# EAGLE schematic 4ButtonSwitch.Rev3.0 (EAGLE 8.6.0)
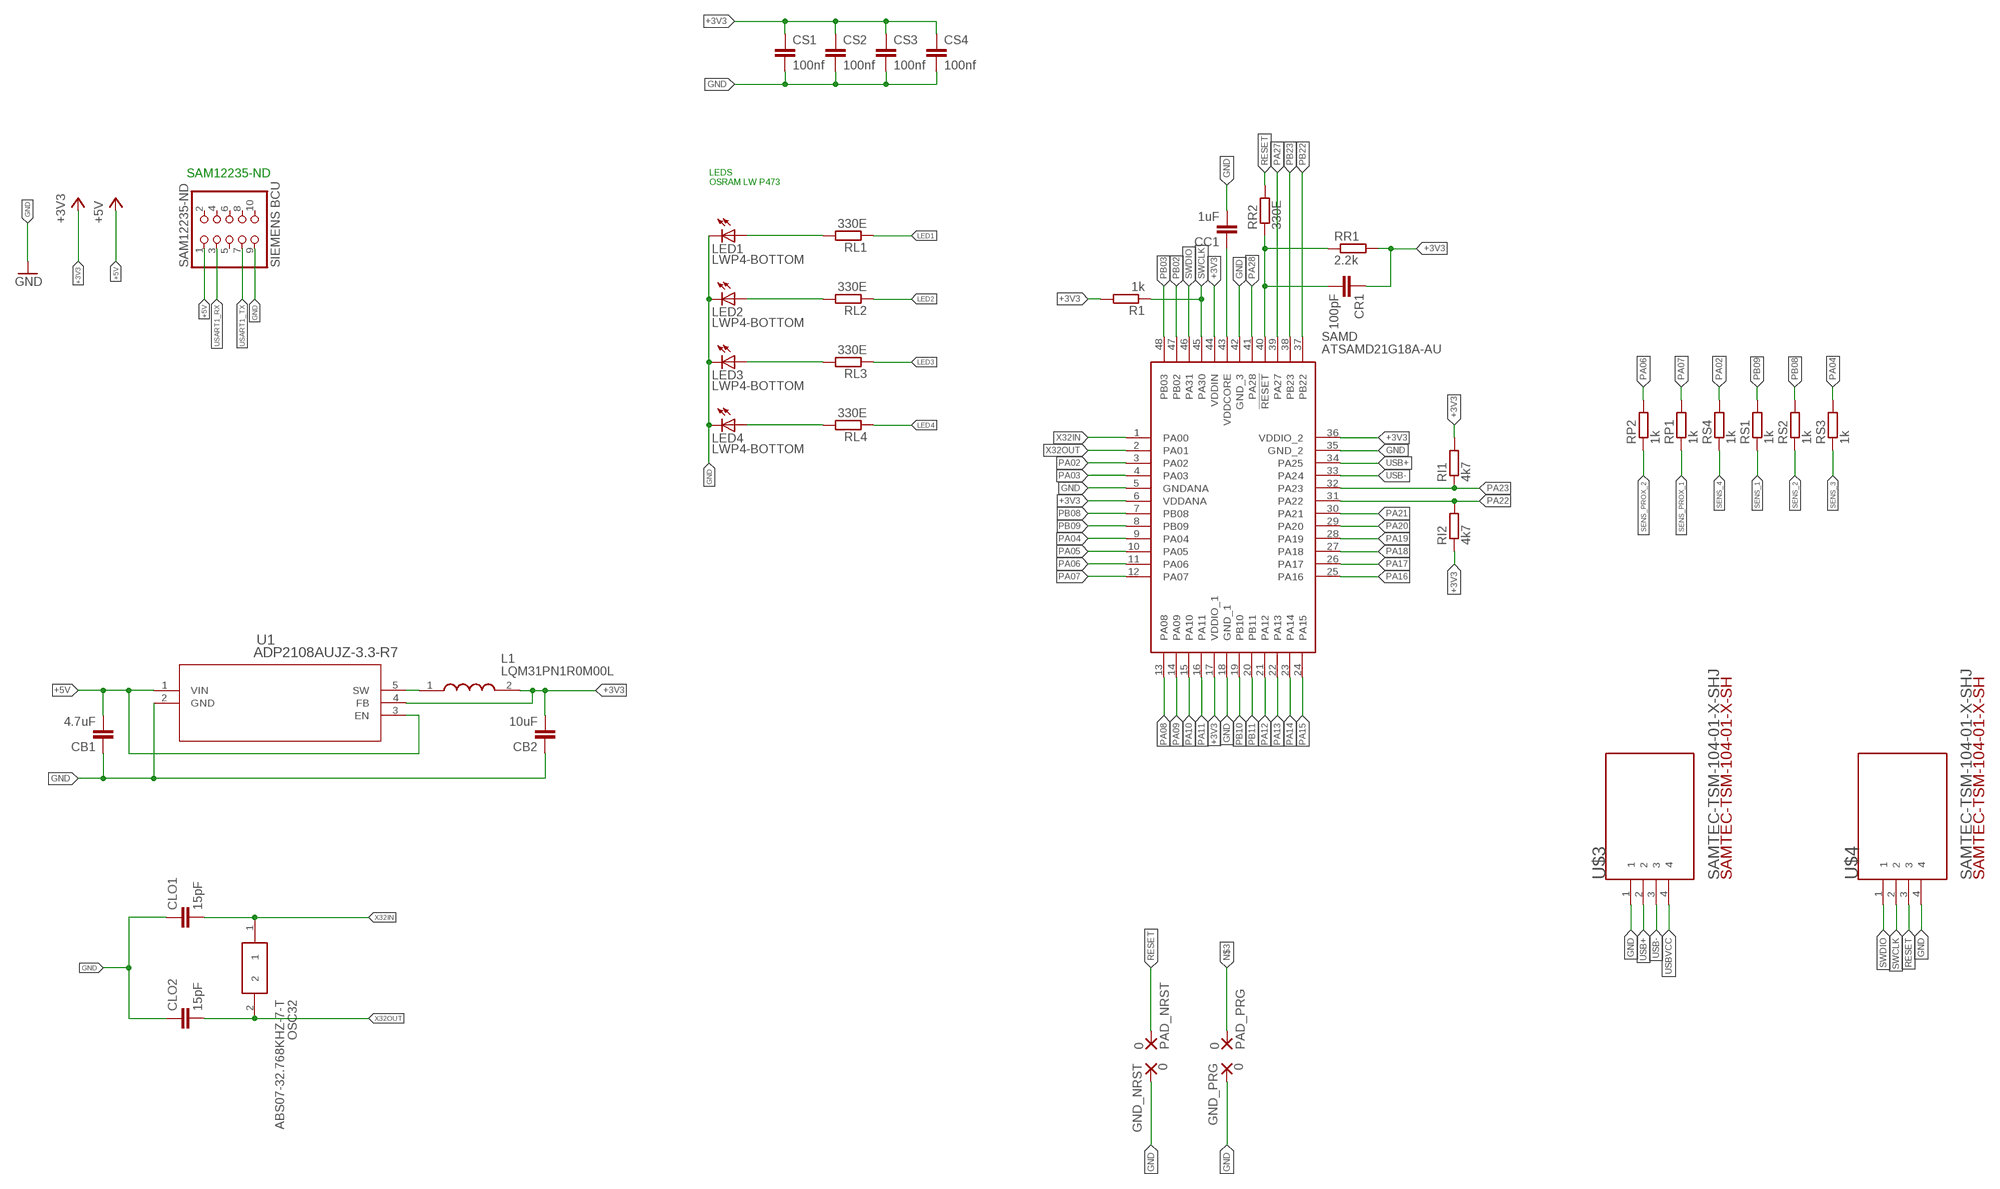
[diagram p0: schematic, sheet 1]

## Parts
CB1  4.7uF  C-EUC1206  [C1206]
CB2  10uF  C-EUC1206  [C1206]
CC1  1uF  C-EUC1206  [C1206]
CLO1  15pF  C-EUC1206  [C1206]
CLO2  15pF  C-EUC1206  [C1206]
CR1  100pF  C-EUC1206  [C1206]
CS1  100nf  C-EUC1206  [C1206]
CS2  100nf  C-EUC1206  [C1206]
CS3  100nf  C-EUC1206  [C1206]
CS4  100nf  C-EUC1206  [C1206]
GND_NRST  0  SMD5  [SMD2,54-5,08]
GND_PRG  0  SMD5  [SMD2,54-5,08]
L1  LQM31PN1R0M00L  [INDC3216X95N]
LED1  LWP4-BOTTOM  [P47F-BOTTOM]
LED2  LWP4-BOTTOM  [P47F-BOTTOM]
LED3  LWP4-BOTTOM  [P47F-BOTTOM]
LED4  LWP4-BOTTOM  [P47F-BOTTOM]
OSC32  ABS07-32.768KHZ-7-T  [ABS-07]
PAD_NRST  0  SMD5  [SMD2,54-5,08]
PAD_PRG  0  SMD5  [SMD2,54-5,08]
R1  1k  R-EU_R1206  [R1206]
RI1  4k7  R-EU_R1206  [R1206]
RI2  4k7  R-EU_R1206  [R1206]
RL1  330E  R-EU_R1206  [R1206]
RL2  330E  R-EU_R1206  [R1206]
RL3  330E  R-EU_R1206  [R1206]
RL4  330E  R-EU_R1206  [R1206]
RP1  1k  R-EU_R1206  [R1206]
RP2  1k  R-EU_R1206  [R1206]
RR1  2.2k  R-EU_R1206  [R1206]
RR2  330E  R-EU_R1206  [R1206]
RS1  1k  R-EU_R1206  [R1206]
RS2  1k  R-EU_R1206  [R1206]
RS3  1k  R-EU_R1206  [R1206]
RS4  1k  R-EU_R1206  [R1206]
SAM12235-ND  SIEMENS BCU  PINHD-2X5_2.54-SMD  [2X05SMD]
SAMD  ATSAMD21G18A-AU  [QFP50P900X900X120-48N]
U1  ADP2108AUJZ-3.3-R7  [UJ_5]
U$3  SAMTEC-TSM-104-01-X-SHJ  [SAMTEC-TSM-104-01-X-SH]
U$4  SAMTEC-TSM-104-01-X-SHJ  [SAMTEC-TSM-104-01-X-SH]

## Nets
+3V3: CB2.2 CR1.1 CS1.1 CS2.1 CS3.1 CS4.1 L1.2 R1.2 RI1.2 RI2.1 RR1.2 SAMD.6(VDDANA) SAMD.17(VDDIO_1) SAMD.36(VDDIO_2) SAMD.44(VDDIN) U1.4(FB)
+5V: CB1.2 SAM12235-ND.1 U1.1(VIN) U1.3(EN)
GND: CB1.1 CB2.1 CC1.2 CLO1.1 CLO2.1 CS1.2 CS2.2 CS3.2 CS4.2 GND_NRST.1(P) GND_PRG.1(P) LED1.C LED2.C LED3.C LED4.C SAM12235-ND.9 SAMD.5(GNDANA) SAMD.18(GND_1) SAMD.35(GND_2) SAMD.42(GND_3) U1.2(GND) U$3.1 U$4.4
LED1: RL1.1
LED2: RL2.1
LED3: RL3.1
LED4: RL4.1
N$2: L1.1 U1.5(SW)
N$3: PAD_PRG.1(P)
N$19: LED1.A RL1.2
N$20: LED2.A RL2.2
N$21: LED3.A RL3.2
N$22: LED4.A RL4.2
NRST: CR1.2 RR1.1 RR2.1 SAMD.40(!RESET)
PA02: RS4.2 SAMD.3(PA02)
PA03: SAMD.4(PA03)
PA04: RS3.2 SAMD.9(PA04)
PA05: SAMD.10(PA05)
PA06: RP2.2 SAMD.11(PA06)
PA07: RP1.2 SAMD.12(PA07)
PA08: SAMD.13(PA08)
PA09: SAMD.14(PA09)
PA10: SAMD.15(PA10)
PA11: SAMD.16(PA11)
PA12: SAMD.21(PA12)
PA13: SAMD.22(PA13)
PA14: SAMD.23(PA14)
PA15: SAMD.24(PA15)
PA16: SAMD.25(PA16)
PA17: SAMD.26(PA17)
PA18: SAMD.27(PA18)
PA19: SAMD.28(PA19)
PA20: SAMD.29(PA20)
PA21: SAMD.30(PA21)
PA22: RI2.2 SAMD.31(PA22)
PA23: RI1.1 SAMD.32(PA23)
PA27: SAMD.39(PA27)
PA28: SAMD.41(PA28)
PB02: SAMD.47(PB02)
PB03: SAMD.48(PB03)
PB08: RS2.2 SAMD.7(PB08)
PB09: RS1.2 SAMD.8(PB09)
PB10: SAMD.19(PB10)
PB11: SAMD.20(PB11)
PB22: SAMD.37(PB22)
PB23: SAMD.38(PB23)
RESET: PAD_NRST.1(P) RR2.2 U$4.3
SENS_1: RS1.1
SENS_2: RS2.1
SENS_3: RS3.1
SENS_4: RS4.1
SENS_PROX_1: RP1.1
SENS_PROX_2: RP2.1
SWCLK: R1.1 SAMD.45(PA30) U$4.2
SWDIO: SAMD.46(PA31) U$4.1
USART1_RX: SAM12235-ND.3
USART1_TX: SAM12235-ND.7
USB+: SAMD.34(PA25) U$3.2
USB-: SAMD.33(PA24) U$3.3
USBVCC: U$3.4
VDDCORE: CC1.1 SAMD.43(VDDCORE)
X32IN: CLO1.2 OSC32.1 SAMD.1(PA00)
X32OUT: CLO2.2 OSC32.2 SAMD.2(PA01)
Unconnected: SAM12235-ND.2 SAM12235-ND.4 SAM12235-ND.5 SAM12235-ND.6 SAM12235-ND.8 SAM12235-ND.10

## Notes on the sheet
- SAM12235-ND
- LEDS
  OSRAM LW P473

## Library data of the parts
CB1 CB2 CC1 CLO1 CLO2 CR1 CS1-CS4 = rcl:C-EU: CAPACITOR, European symbol; SPICEPREFIX: C
GND_NRST GND_PRG PAD_NRST PAD_PRG = wirepad:SMD5: SMD PAD
L1 = LQM31PN1R0M00L:LQM31PN1R0M00L: Murata LQM31P_00 Series 1000 nH 20% Ferrite Multilayer SMD Inductor, 1206 Case, SRF: 0.06GHz 1200mA dc 150m Rdc Source: Datasheet <http://docs-europe.electrocomponents.com/webdocs/1256/0900766b812561f7.pdf>; ARROW_PART_NUMBER: LQM31PN1R0M00L; ARROW_PRICE-STOCK: http://uk.rs-online.com/web/p/products/1674189; DESCRIPTION: Murata LQM31P_00 Series 1000 nH 20% Ferrite Multilayer SMD Inductor, 1206 Case, SRF: 0.06GHz 1200mA dc 150m Rdc; HEIGHT: 0.95mm; MANUFACTURER_NAME: Murata Electronics; MANUFACTURER_PART_NUMBER: LQM31PN1R0M00L; RS_PART_NUMBER: 1674189; RS_PRICE-STOCK: http://uk.rs-online.com/web/p/products/1674189
LED1-LED4 = led:*P4: PointLED® Enhanced Thinfilm LED TOP & BOTTOM mount LS P47F, LR P47F, LA P47F, LY P47F, LT P4SG, LB P4SG, LW P4SG Source: http://catalog.osram-os.com .. LA_LR_LS_LY_P47F_Pb_free.pdf
OSC32 = ABS07-32.768KHZ-7-T:ABS07-32.768KHZ-7-T: ABRACON - ABS07-32.768KHZ-7-T - CRYSTAL, 32.768KHZ, 7PF, SMD Source: Datasheet <https://componentsearchengine.com/Datasheets/2/ABS07-32.768KHZ-7-T.pdf>; ARROW_PART_NUMBER: ABS07-32.768KHZ-7-T; ARROW_PRICE/STOCK: https://www.arrow.com/en/products/abs07-32.768khz-7-t/abracon; DESCRIPTION: ABRACON - ABS07-32.768KHZ-7-T - CRYSTAL, 32.768KHZ, 7PF, SMD; HEIGHT: mm; MANUFACTURER_NAME: ABRACON; MANUFACTURER_PART_NUMBER: ABS07-32.768KHZ-7-T; RS_PART_NUMBER: 1712773P; RS_PRICE/STOCK: http://uk.rs-online.com/web/p/products/1712773P
R1 RI1 RI2 RL1-RL4 RP1 RP2 RR1 RR2 RS1-RS4 = resistor:R-EU_: RESISTOR, European symbol
SAM12235-ND = pinhead:PINHD-2X5: PIN HEADER
SAMD = ATSAMD21G18A-AU:ATSAMD21G18A-AU: ATMEL - ATSAMD21G18A-AU - MCU, 32BIT, CORTEX-M0+, 48MHZ, TQFP-48 Source: Datasheet <http://www.farnell.com/datasheets/1807566.pdf>; ARROW_PART_NUMBER: ATSAMD21G18A-AU; ARROW_PRICE-STOCK: https://www.arrow.com/en/products/atsamd21g18a-au/microchip-technology; DESCRIPTION: ATMEL - ATSAMD21G18A-AU - MCU, 32BIT, CORTEX-M0+, 48MHZ, TQFP-48; HEIGHT: 1.2mm; MANUFACTURER_NAME: Microchip; MANUFACTURER_PART_NUMBER: ATSAMD21G18A-AU; RS_PART_NUMBER: 1773799P; RS_PRICE-STOCK: http://uk.rs-online.com/web/p/products/1773799P
U1 = ADP2108AUJZ-3.3-R7CT-ND:ADP2108AUJZ-3.3-R7; MANUFACTURER_PART_NUMBER: ADP2108AUJZ3.3R7; VENDOR: Analog Devices Inc
U$3 U$4 = SAMTEC-TSM-104-01-X-SH:SAMTEC-TSM-104-01-X-SH; AVAILABILITY: Good; DESCRIPTION: HEADER, 2.54MM, SMT, 4POS; Series: TSM; Pitch Spacing: 2.54mm; No. of Rows: 1; No.; MF: Samtec; MP: TSM-104-01-T-SH; PACKAGE: None; PRICE: 0.31 USD